# Altium schematic sheet Power.SchDoc: FET Active Probe
size A4; DocumentNumber: 2; SheetNumber: 2; SheetTotal: 2
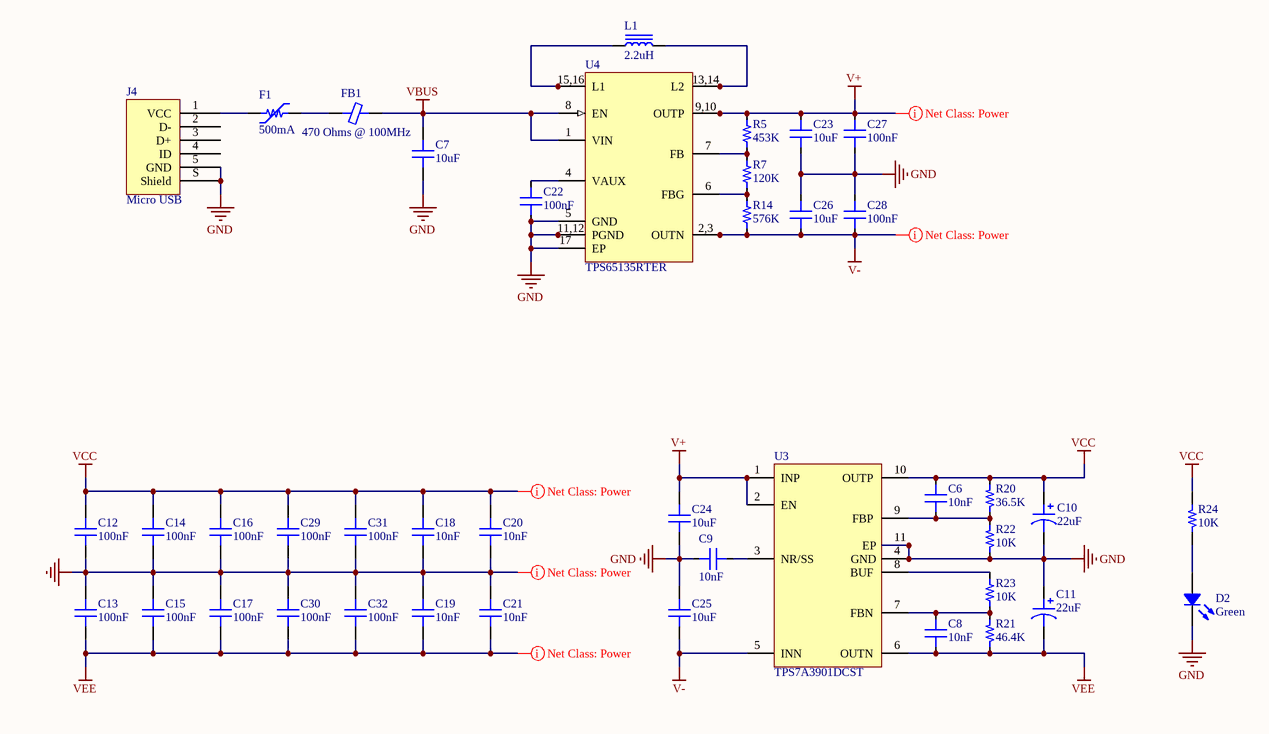
[diagram p0: Power.SchDoc]

## Parts
C6  10nF  [CAP 0402/1005]
C7  10uF  [CAP 0603/1608]
C8  10nF  [CAP 0402/1005]
C9  10nF  [CAP 0402/1005]
C10  22uF  [CAP TAN 3528 - 2.1MM]
C11  22uF  [CAP TAN 3528 - 2.1MM]
C12  100nF  [CAP 0402/1005]
C13  100nF  [CAP 0402/1005]
C14  100nF  [CAP 0204/0510]
C15  100nF  [CAP 0204/0510]
C16  100nF  [CAP 0204/0510]
C17  100nF  [CAP 0204/0510]
C18  10nF  [CAP 0402/1005]
C19  10nF  [CAP 0402/1005]
C20  10nF  [CAP 0402/1005]
C21  10nF  [CAP 0402/1005]
C22  100nF  [CAP 0402/1005]
C23  10uF  [CAP 0603/1608]
C24  10uF  [CAP 0603/1608]
C25  10uF  [CAP 0603/1608]
C26  10uF  [CAP 0603/1608]
C27  100nF  [CAP 0402/1005]
C28  100nF  [CAP 0402/1005]
C29  100nF  [CAP 0204/0510]
C30  100nF  [CAP 0204/0510]
C31  100nF  [CAP 0204/0510]
C32  100nF  [CAP 0204/0510]
D2  Green  [LED 0805/2012 GREEN]
F1  500mA  [PPTC 1206/3216]
FB1  470 Ohms @ 100MHz  [FER 0603/1608]
J4  Micro USB  [FCI USB 10118193-0001LF]
L1  2.2uH  [TDK VLS201612CX]
R5  453K  [RES 0402/1005]
R7  120K  [RES 0402/1005]
R14  576K  [RES 0402/1005]
R20  36.5K  [RES 0402/1005]
R21  46.4K  [RES 0402/1005]
R22  10K  [RES 0402/1005]
R23  10K  [RES 0402/1005]
R24  10K  [RES 0603/1608]
U3  TPS7A3901DCST  [DFN50P300X300X80_HS-11N]
U4  TPS65135RTER  [QFN50P305X305X100_HS-17N]

## Nets
GND: C7.1 C9.2 C10.2 C11.1 C12.2 C13.1 C14.2 C15.1 C16.2 C17.1 C18.2 C19.1 C20.2 C21.1 C22.2 C23.2 C24.2 C25.2 C26.1 C27.2 C28.1 C29.2 C30.1 C31.2 C32.1 D2.2 J4.5(GND) J4.S(Shield) R22.2 U3.4(GND) U3.11(EP) U4.5(GND) U4.11(PGND) U4.12(PGND) U4.17(EP)
V+: C23.1 C24.1 C27.1 R5.2 U3.1(INP) U3.2(EN) U4.9(OUTP) U4.10(OUTP)
V-: C25.1 C26.2 C28.2 R14.1 U3.5(INN) U4.2(OUTN) U4.3(OUTN)
VBUS: C7.2 FB1.2 U4.1(VIN) U4.8(EN)
VCC: C6.2 C10.1 C12.1 C14.1 C16.1 C18.1 C20.1 C29.1 C31.1 R20.1 R24.1 U3.10(OUTP)
VEE: C8.2 C11.2 C13.2 C15.2 C17.2 C19.2 C21.2 C30.2 C32.2 R21.2 U3.6(OUTN)
NetC6_1: C6.1 R20.2 R22.1 U3.9(FBP)
NetC8_1: C8.1 R21.1 R23.1 U3.7(FBN)
NetC9_1: C9.1 U3.3(NR/SS)
NetC22_1: C22.1 U4.4(VAUX)
NetD2_1: D2.1 R24.2
NetF1_1: F1.1 J4.1(VCC)
NetF1_2: F1.2 FB1.1
NetL1_1: L1.1 U4.15(L1) U4.16(L1)
NetL1_2: L1.2 U4.13(L2) U4.14(L2)
NetR5_1: R5.1 R7.2 U4.7(FB)
NetR7_1: R7.1 R14.2 U4.6(FBG)
NetR23_2: R23.2 U3.8(BUF)

Not connected (* = marked no-connect by the designer): J4 2(D-) 3(D+) 4(ID)

## Layout directives
net class Power: GND, V+, V-, VCC, VEE

## Notes on the sheet
- Title
- Size:
- Date:
- A4
- Number:
- Time:
- Revision:
- Sheet
- of
- File:
- (in symbol URS042) 15,16; 13,14; 9,10; 11,12; 2,3

## Library data of the parts
C6 C8 C9 = CM2150: CAP CER 10NF 25V NP0 0402; Manufacturer: Murata; Part Number: GRM1555C1E103GE01D; Tolerance: 2%; TemperatureRange: -55C ~ 125C; TemperatureCoefficient: C0G, NP0; Value: 10nF; PartId: CM2150; Supplier 1: Mouser; Supplier Part Number 1: 81-GRM1555C1E103GE1D; ComponentLink1Description: Datasheet; ComponentLink1URL: https://www.murata.com/en-global/products/productdetail?partno=GRM1555C1E103GE01%23; Voltage: 25V; Supplier 2: Digi-Key; Supplier Part Number 2: 490-GRM1555C1E103GE01DTR-ND; Price: 0.1; Device Package: 0402 (1005 Metric)
C7 C23 C26 = CM0904: CAP CER 10UF 16V X5R 0603; Part Number: GRM188R61C106MA73D; Manufacturer: Murata Electronics North America; TemperatureRange: -55C ~ 85C; Tolerance: 20%; Value: 10uF; PartId: CM0904; Supplier 1: Digi-Key; Supplier Part Number 1: 490-7201-2-ND; ComponentLink1Description: Datasheet; ComponentLink1URL: http://www.murata.com/~/media/webrenewal/support/library/catalog/products/capacitor/mlcc/c02e.pdf; ComponentLink2Description: Digi-Key Listing; ComponentLink2URL: https://www.digikey.com/product-detail/en/murata-electronics-north-america/GRM188R61C106MA73D/490-7201-2-ND/3900480; TemperatureCoefficient: X5R; Voltage: 16V; Price: 0.0736; Device Package: 0603 (1608 Metric)
C10 C11 = CAT304: CAP TANT 22UF 16V 3528; Manufacturer: AVX; Part Number: 293D226X0016B2TE3; Tolerance: 20%; Ripple Current: 0.21A; TemperatureRange: -55C ~ 125C; Impedance: 1.9Ohm @ 100kHz; Lifetime @ Temp: 1000 Hrs @ 85C; Supplier 1: Mouser; Supplier Part Number 1: 74-293D226X0016B2TE3; Series: 293D; Voltage: 16V; Height: 2.1mm; ComponentLink1URL: https://www.vishay.com/docs/40002/293d.pdf; ComponentLink1Description: Datasheet; Value: 22uF; PartID: CAT304; Device Package: 3528 x 2.1mm (Case B)
C12 C13 = CM0464: CAP CER 100NF 25V X5R 0402; Manufacturer: Murata; Part Number: GRM155R61E104KA87D; Tolerance: 10%; TemperatureRange: -55C ~ 85C; Supplier 1: Digi-Key; Voltage: 25V; ComponentLink1URL: http://www.murata.com/~/media/webrenewal/support/library/catalog/products/capacitor/mlcc/c02e.pdf; ComponentLink1Description: Datasheet; ComponentLink2URL: https://www.digikey.com/product-detail/en/murata-electronics-north-america/GRM155R61E104KA87D/490-5920-2-ND/3693681; ComponentLink2Description: Digi-Key Listing; Supplier Part Number 1: 490-5920-2-ND; PartId: CM0464; Value: 100nF; TemperatureCoefficient: X5R; Price: 0.0048; Device Package: 0402 (1005 Metric)
C14-C17 = CLW004: CAP CER 100NF 25V X5R 0204; Part Number: MSRLT103SB5104MFNA01; Manufacturer: Taiyo Yuden; TemperatureRange: -55C ~ 85C; Tolerance: 20%; Type: Reversal Decoupling Low ESL; PartId: CLW004; Value: 100nF; Supplier 1: Mouser; ComponentLink1Description: Datasheet; ComponentLink1URL: https://ds.yuden.co.jp/TYCOMPAS/or/detail?pn=MSRLT103SB5104MFNA01; TemperatureCoefficient: X5R; Voltage: 25V; Price: 0.02; Device Package: 0204 (0510 Metric); Supplier Part Number 1: 963-MSRLT103SB5104MFNA01
C18-C21 = CM2150: CAP CER 10NF 25V NP0 0402; Part Number: GRM1555C1E103GE01D; Manufacturer: Murata; Tolerance: 2%; TemperatureRange: -55C ~ 125C; TemperatureCoefficient: C0G, NP0; Value: 10nF; PartId: CM2150; Supplier 1: Mouser; Supplier Part Number 1: 81-GRM1555C1E103GE1D; ComponentLink1Description: Datasheet; ComponentLink1URL: https://www.murata.com/en-global/products/productdetail?partno=GRM1555C1E103GE01%23; Voltage: 25V; Price: 0.1; Device Package: 0402 (1005 Metric); Supplier 2: Digi-Key; Supplier Part Number 2: 490-GRM1555C1E103GE01DTR-ND
C22 = CM0464: CAP CER 100NF 25V X5R 0402; Part Number: GRM155R61E104KA87D; Manufacturer: Murata; TemperatureRange: -55C ~ 85C; Tolerance: 10%; Value: 100nF; PartId: CM0464; Supplier 1: Digi-Key; Supplier Part Number 1: 490-5920-2-ND; ComponentLink1Description: Datasheet; ComponentLink1URL: http://www.murata.com/~/media/webrenewal/support/library/catalog/products/capacitor/mlcc/c02e.pdf; ComponentLink2Description: Digi-Key Listing; ComponentLink2URL: https://www.digikey.com/product-detail/en/murata-electronics-north-america/GRM155R61E104KA87D/490-5920-2-ND/3693681; TemperatureCoefficient: X5R; Voltage: 25V; Price: 0.0048; Device Package: 0402 (1005 Metric)
C24 C25 = CM0904: CAP CER 10UF 16V X5R 0603; Manufacturer: Murata; Part Number: GRM188R61C106MA73D; TemperatureRange: -55C ~ 85C; Tolerance: 20%; Supplier 1: Digi-Key; Supplier Part Number 1: 490-7201-2-ND; ComponentLink1URL: http://www.murata.com/~/media/webrenewal/support/library/catalog/products/capacitor/mlcc/c02e.pdf; ComponentLink1Description: Datasheet; ComponentLink2URL: https://www.digikey.com/product-detail/en/murata-electronics-north-america/GRM188R61C106MA73D/490-7201-2-ND/3900480; ComponentLink2Description: Digi-Key Listing; PartId: CM0904; Value: 10uF; TemperatureCoefficient: X5R; Voltage: 16V; Price: 0.0736; Device Package: 0603 (1608 Metric)
C27 C28 = CM0464: CAP CER 100NF 25V X5R 0402; Part Number: GRM155R61E104KA87D; Manufacturer: Murata Electronics North America; TemperatureRange: -55C ~ 85C; Tolerance: 10%; Value: 100nF; PartId: CM0464; Supplier 1: Digi-Key; Supplier Part Number 1: 490-5920-2-ND; ComponentLink1Description: Datasheet; ComponentLink1URL: http://www.murata.com/~/media/webrenewal/support/library/catalog/products/capacitor/mlcc/c02e.pdf; ComponentLink2Description: Digi-Key Listing; ComponentLink2URL: https://www.digikey.com/product-detail/en/murata-electronics-north-america/GRM155R61E104KA87D/490-5920-2-ND/3693681; TemperatureCoefficient: X5R; Voltage: 25V; Price: 0.0048; Device Package: 0402 (1005 Metric)
C29-C32 = CLW004: CAP CER 100NF 25V X5R 0204; Manufacturer: Taiyo Yuden; Part Number: MSRLT103SB5104MFNA01; Tolerance: 20%; TemperatureRange: -55C ~ 85C; Type: Reversal Decoupling Low ESL; Supplier 1: Mouser; ComponentLink1URL: https://ds.yuden.co.jp/TYCOMPAS/or/detail?pn=MSRLT103SB5104MFNA01; ComponentLink1Description: Datasheet; PartId: CLW004; Value: 100nF; TemperatureCoefficient: X5R; Voltage: 25V; Price: 0.02; Device Package: 0204 (0510 Metric); Supplier Part Number 1: 963-MSRLT103SB5104MFNA01
D2 = LS0073: LED GREEN CLEAR 0805 SMD; Manufacturer: Lite-On Inc.; Part Number: LTST-C171KGKT; Viewing Angle: 130; Type: Surface Mount; Millicandela: 35mcd; Voltage Forward: 2V; Current (Test): 20mA; Supplier 1: Digi-Key; Supplier Part Number 1: 160-1426-2-ND; ComponentLink1URL: http://optoelectronics.liteon.com/upload/download/DS22-2000-118/LTST-C171KGKT.pdf; ComponentLink1Description: Datasheet; ComponentLink2URL: http://www.digikey.ca/product-detail/en/LTST-C171KGKT/160-1426-2-ND/386799; ComponentLink2Description: Digi-Key Listing; Value: Green; Colour: Green; PartId: LS0073; Price: 0.0638; Device Package: 0805 (2012 Metric); Lens Transparency: Clear
F1 = FP0006: PTC RESET FUSE 13.2V 500MA 1206; Part Number: NANOSMDC050F/13.2-2; Manufacturer: Littelfuse; TemperatureRange: -45C ~ 85C; Current - Max: 100A; Current - Trip (It): 1.1A; Time to Trip: 100ms; Resistance - Initial (Ri) (Min): 200 mOhms; Resistance - Post Trip (R1) (Max): 750 mOhms; PartId: FP0006; Supplier 1: Mouser; Supplier Part Number 1: 650-NANOSMDC050F/13.2-2; ComponentLink1Description: Datasheet; ComponentLink1URL: https://www.littelfuse.com/~/media/electronics/datasheets/resettable_ptcs/littelfuse_ptc_nanosmdc_datasheet.pdf.pdf; Type: PPTC; Voltage - Max: 13.2V; Current - Hold (Ih) (Max): 500mA; Supplier 2: Digikey; Supplier Part Number 2: NANOSMDC050F/13.2-2CT-ND; Price: 0.48; Device Package: 1206 (3216 Metric), Concave
FB1 = FTP046: FERRITE BEAD 470 OHM 0603 1LN; Part Number: MPZ1608B471ATA00; Manufacturer: TDK; DC Resistance: 150 mOhm; Current Rating: 1A; PartId: FTP046; Value: 470 Ohms @ 100MHz; Supplier 1: Digi-Key; Supplier Part Number 1: 445-5218-1-ND; ComponentLink1Description: Datasheet; ComponentLink1URL: https://product.tdk.com/info/en/catalog/datasheets/beads_commercial_power_mpz1608_en.pdf; Price: 0.1; Device Package: 0603 (1608 Metric)
J4 = CU0001: CONN USB MICRO B RECPT SMT R/A; Part Number: 10118193-0001LF; Manufacturer: FCI; Number Of Positions: 5; PartId: CU0001; Supplier 1: Digi-Key; Supplier Part Number 1: 609-4616-2-ND; ComponentLink1Description: Datasheet; ComponentLink1URL: http://portal.fciconnect.com/Comergent//fci/drawing/10118193.pdf; ComponentLink2Description: Digi-Key Listing; ComponentLink2URL: http://www.digikey.ca/product-detail/en/10118193-0001LF/609-4616-2-ND/2785388; Type: USB - micro B
L1 = ITV008: FIXED IND 2.2UH 1.5A 140 MOHM; Part Number: VLS201612CX-2R2M-1; Manufacturer: TDK; Tolerance: 20%; Current - Saturation: 1.33A; DC Resistance (DCR): 140 mOhm Max; Value: 2.2uH; PartId: ITV008; Supplier 1: Digi-Key; Supplier Part Number 1: 445-172963-1-ND; ComponentLink1Description: Datasheet; ComponentLink1URL: https://product.tdk.com/info/en/catalog/datasheets/inductor_commercial_power_vls201612cx-1_en.pdf; Device Package: 0806 (2016 Metric); Current Rating: 1.5A; Operating Temperature: 140 mOhm Max
R5 = RC1762: RES SMD 453K OHM 1% 1/16W 0402; Part Number: RC0402FR-07453KL; Manufacturer: Yageo; TemperatureRange: -55C ~ 155C; TemperatureCoefficient: 100ppm/C; PowerRating: 0.0625W, 1/16W; PartId: RC1762; Value: 453K; Supplier 1: Mouser; Supplier Part Number 1: 603-RC0402FR-07453KL; ComponentLink1Description: Datasheet; ComponentLink1URL: http://www.yageo.com/NewPortal/yageodocoutput?fileName=/pdf/R-Chip/PYu-RC_Group_51_RoHS_L_9.pdf; Tolerance: 1%; Price: 0.0043; Type: Thick Film; Device Package: 0402 (1005 Metric)
R7 = RC1682: RES SMD 120K OHM 1% 1/16W 0402; Part Number: RC0402FR-07120KL; Manufacturer: Yageo; TemperatureRange: -55C ~ 155C; TemperatureCoefficient: 100ppm/C; PowerRating: 0.0625W, 1/16W; PartId: RC1682; Value: 120K; Supplier 1: Mouser; Supplier Part Number 1: 603-RC0402FR-07120KL; ComponentLink1Description: Datasheet; ComponentLink1URL: http://www.yageo.com/NewPortal/yageodocoutput?fileName=/pdf/R-Chip/PYu-RC_Group_51_RoHS_L_9.pdf; Tolerance: 1%; Price: 0.0043; Type: Thick Film; Device Package: 0402 (1005 Metric)
R14 = RC1778: RES SMD 576K OHM 1% 1/16W 0402; Part Number: RC0402FR-07576KL; Manufacturer: Yageo; TemperatureRange: -55C ~ 155C; TemperatureCoefficient: 100ppm/C; PowerRating: 0.0625W, 1/16W; PartId: RC1778; Value: 576K; Supplier 1: Mouser; Supplier Part Number 1: 603-RC0402FR-07576KL; ComponentLink1Description: Datasheet; ComponentLink1URL: http://www.yageo.com/NewPortal/yageodocoutput?fileName=/pdf/R-Chip/PYu-RC_Group_51_RoHS_L_9.pdf; Tolerance: 1%; Price: 0.0043; Type: Thick Film; Device Package: 0402 (1005 Metric)
R20 = RC1608: RES SMD 36.5K OHM 1% 1/16W 0402; Part Number: RC0402FR-0736K5L; Manufacturer: Yageo; TemperatureRange: -55C ~ 155C; TemperatureCoefficient: 100ppm/C; PowerRating: 0.0625W, 1/16W; Value: 36.5K; PartId: RC1608; Supplier 1: Mouser; Supplier Part Number 1: 603-RC0402FR-0736K5L; ComponentLink1Description: Datasheet; ComponentLink1URL: http://www.yageo.com/NewPortal/yageodocoutput?fileName=/pdf/R-Chip/PYu-RC_Group_51_RoHS_L_9.pdf; Tolerance: 1%; Price: 0.0043; Type: Thick Film; Device Package: 0402 (1005 Metric)
R21 = RC1623: RES SMD 46.4K OHM 1% 1/16W 0402; Part Number: RC0402FR-0746K4L; Manufacturer: Yageo; TemperatureRange: -55C ~ 155C; TemperatureCoefficient: 100ppm/C; PowerRating: 0.0625W, 1/16W; Value: 46.4K; PartId: RC1623; Supplier 1: Mouser; Supplier Part Number 1: 603-RC0402FR-0746K4L; ComponentLink1Description: Datasheet; ComponentLink1URL: http://www.yageo.com/NewPortal/yageodocoutput?fileName=/pdf/R-Chip/PYu-RC_Group_51_RoHS_L_9.pdf; Tolerance: 1%; Price: 0.0043; Type: Thick Film; Device Package: 0402 (1005 Metric)
R22 R23 = RC1531: RES SMD 10K OHM 1% 1/16W 0402; Part Number: RC0402FR-0710KL; Manufacturer: Yageo; TemperatureRange: -55C ~ 155C; TemperatureCoefficient: 100ppm/C; PowerRating: 0.0625W, 1/16W; Value: 10K; PartId: RC1531; Supplier 1: Mouser; Supplier Part Number 1: 603-RC0402FR-0710KL; ComponentLink1Description: Datasheet; ComponentLink1URL: http://www.yageo.com/NewPortal/yageodocoutput?fileName=/pdf/R-Chip/PYu-RC_Group_51_RoHS_L_9.pdf; Tolerance: 1%; Price: 0.0043; Type: Thick Film; Device Package: 0402 (1005 Metric)
R24 = RC2513: RES SMD 10K OHM 5% 1/10W 0603; Part Number: RC0603JR-0710KL; Manufacturer: Yageo; TemperatureRange: -55C ~ 155C; TemperatureCoefficient: 100ppm/C; PowerRating: 0.1W, 1/10W; Value: 10K; PartId: RC2513; Supplier 1: Mouser; Supplier Part Number 1: 603-RC0603JR-0710KL; ComponentLink1Description: Datasheet; ComponentLink1URL: http://www.yageo.com/NewPortal/yageodocoutput?fileName=/pdf/R-Chip/PYu-RC_Group_51_RoHS_L_9.pdf; Tolerance: 5%; Price: 0.0043; Type: Thick Film; Device Package: 0603 (1608 Metric)
U3 = URL095: IC REG LIN POS/NEG ADJ 10WSON; Manufacturer: TI; Output Voltage: Adjustable; Output Current: 150mA; Input Voltage MAX: 30V; PartId: URL095; Part Number: TPS7A3901DCST; Supplier 1: Digi-Key; Supplier Part Number 1: 296-47504-1-ND; Supplier 2: Mouser; Supplier Part Number 2: 595-TPS7A3901DCST; ComponentLink1Description: Datasheet; ComponentLink1URL: https://www.ti.com/lit/gpn/tps7a39; Price: 1.5; Type: LDO; Device Package: 10-WFDFN; Operating Temperature: -40C ~ 125C
U4 = URS042: IC REG BOOST INV DUAL 16WQFN; Manufacturer: TI; PartId: URS042; Part Number: TPS65135RTER; Supplier 1: Mouser; Supplier Part Number 1: 595-TPS65135RTER; Supplier 2: Digi-Key; Supplier Part Number 2: 296-29899-2-ND; ComponentLink1Description: Datasheet; ComponentLink1URL: https://www.ti.com/lit/ds/symlink/tps65135.pdf; Price: 0.8; Type: Boost-Invert; Device Package: 16-WQFN; Operating Temperature: -40C ~ 85C